# EAGLE design prize_delivery (EAGLE 9.6.2)
REV: 5
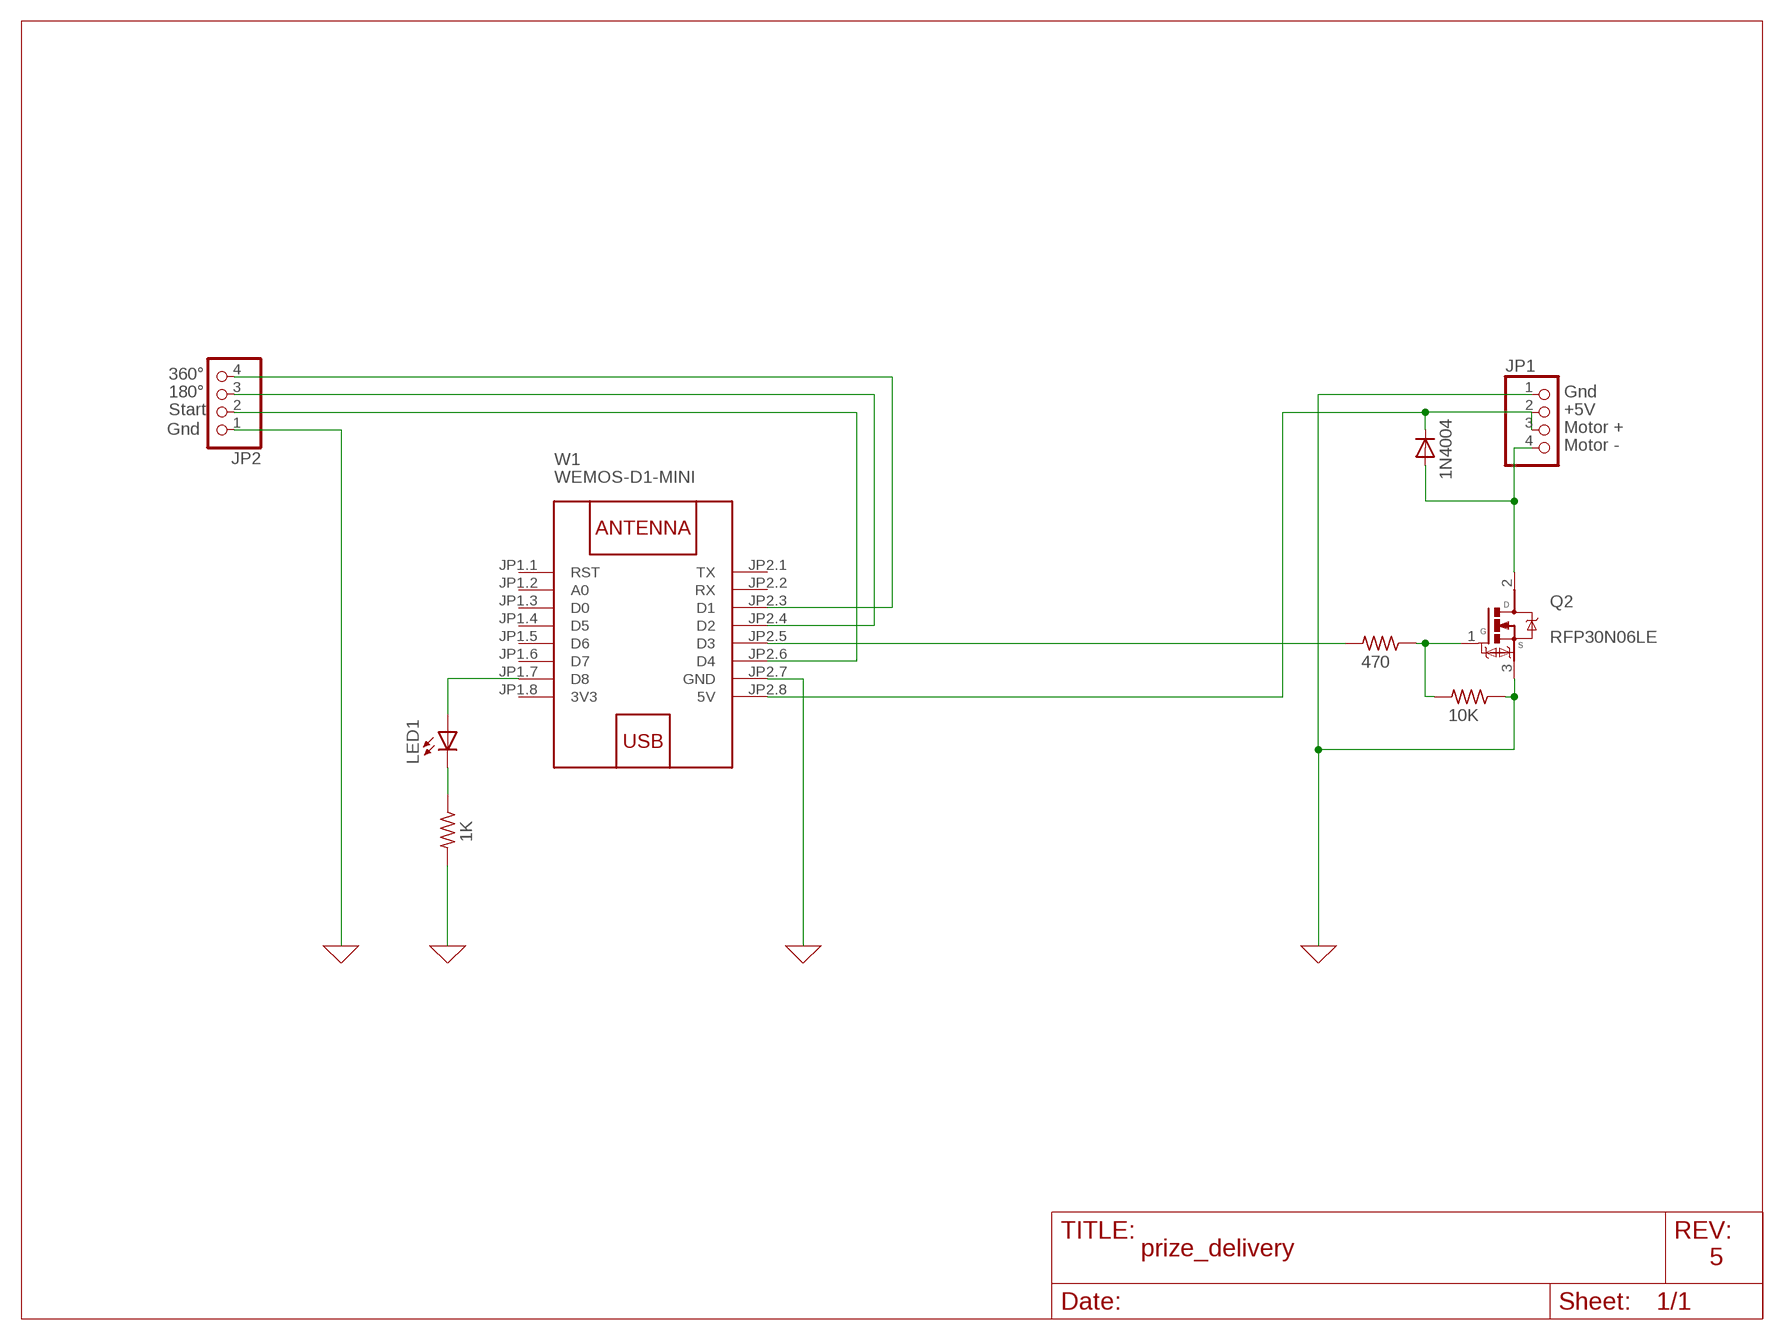
[diagram p0: schematic, sheet 1]

## Parts
D1  1N4004  [DO41-10]
JP1  PINHD-1X4  [1X04]
JP2  PINHD-1X4  [1X04]
LED1  LED5MM  [LED5MM]
Q2  RFP30N06LE  [TRANS_RFP30N06LE]
R1  1K  R-US_0207/10  [0207/10]
R2  470  R-US_0207/10  [0207/10]
R4  10K  R-US_0207/10  [0207/10]
W1  WEMOS-D1-MINI  [WEMOS-D1-MINI]

## Nets
0: JP1.1 JP2.1 Q2.3(S) R1.2 R4.1 W1.JP2.7(GND) ; supply symbol labelled GND
N$1: R2.2 W1.JP2.5(D3)
N$2: D1.A JP1.4 Q2.2(D)
N$3: D1.C JP1.2 JP1.3 W1.JP2.8(5V)
N$4: JP2.3 W1.JP2.4(D2)
N$5: JP2.4 W1.JP2.3(D1)
N$6: LED1.A W1.JP1.7(D8)
N$7: LED1.K(C) R1.1
N$8: Q2.1(G) R2.1 R4.2
N$9: JP2.2 W1.JP2.6(D4)
Unconnected: W1.JP1.1(RST) W1.JP1.2(A0) W1.JP1.3(D0) W1.JP1.4(D5) W1.JP1.5(D6) W1.JP1.6(D7) W1.JP2.1(TX) W1.JP2.2(RX)

## Notes on the sheet
- 360°
- 180° | Gnd
- Start | +5V
- Gnd | Motor +
- Motor -
- 5

## Power pins joined to a net without a drawn wire
3V3: W1.JP1.8(3V3)

## Library data of the parts
D1 = adafruit:1N4004: DIODE General purpose 1N400x type rectifier (With bigger pads) http://www.ladyada.net/library/pcb/eaglelibrary.html
JP1 JP2 = pinhead:PINHD-1X4: PIN HEADER
LED1 = adafruit:LED: LED OSRAM: - CHIPLED LG R971, LG N971, LY N971, LG Q971, LY Q971, LO R971, LY R971 LH N974, LH R974 LS Q976, LO Q976, LY Q976 LO Q996 - Hyper CHIPLED LW Q18S LB Q993, LB Q99A, LB R99A - SideLED LS A670, LO A670, LY A670, LG A670, LP A670 LB A673, LV A673, LT A673, LW A673 LH A674 LY A675 LS A676, LA A676, LO A676, LY A676, LW A676 LS A679, LY A679, LG A679 - Hyper Micro SIDELED® LS Y876, LA Y876, LO Y876, LY Y876 LT Y87S - SmartLED LW L88C, LW L88S LB L89C, LB L89S, LG L890 LS L89K, LO L89K, LY L89K LS L896, LA L896, LO L896, LY L896 - TOPLED LS T670, LO T670, LY T670, LG T670, LP T670 LSG T670, LSP T670, LSY T670, LOP T670, LYG T670 LG T671, LOG T671, LSG T671 LB T673, LV T673, LT T673, LW T673 LH T674 LS T676, LA T676, LO T676, LY T676, LB T676, LH T676, LSB T676, LW T676 LB T67C, LV T67C, LT T67C, LS T67K, LO T67K, LY T67K, LW E67C LS E67B, LA E67B, LO E67B, LY E67B, LB E67C, LV E67C, LT E67C LW T67C LS T679, LY T679, LG T679 LS T770, LO T770, LY T770, LG T770, LP T770 LB T773, LV T773, LT T773, LW T773 LH T774 LS E675, LA E675, LY E675, LS T675 LS T776, LA T776, LO T776, LY T776, LB T776 LHGB T686 LT T68C, LB T68C - Hyper Mini TOPLED® LB M676 - Mini TOPLED Santana® LG M470 LS M47K, LO M47K, LY M47K Source: http://www.osram.convergy.de/
Q2 = RFP30N06LE:RFP30N06LE: Mosfet n-Ch 60v 30a To-220ab - Rfp30n06le Check availability <https://pricing.snapeda.com/parts/RFP30N06LE/ON%20Semiconductor/view-part?ref=eda>; AVAILABILITY: In Stock; DESCRIPTION: N-Channel 60 V 30A (Ta) 96W (Tc) Through Hole TO-220-3; MF: ON Semiconductor; MP: RFP30N06LE; PACKAGE: Package; PRICE: None; PURCHASE-URL: https://pricing.snapeda.com/search?q=RFP30N06LE&ref=eda
R1 R2 R4 = adafruit:R-US_: RESISTOR, American symbol
W1 = diy-modules:WEMOS-D1-MINI: WEMOS D1 mini: Mini Wi-Fi Board based on ESP-8266 device More details can be found here: https://www.wemos.cc/product/d1-mini.html Click here to find device on ebay.com <http://www.ebay.com/sch/wemos+d1+mini+nodemcu>

## Board
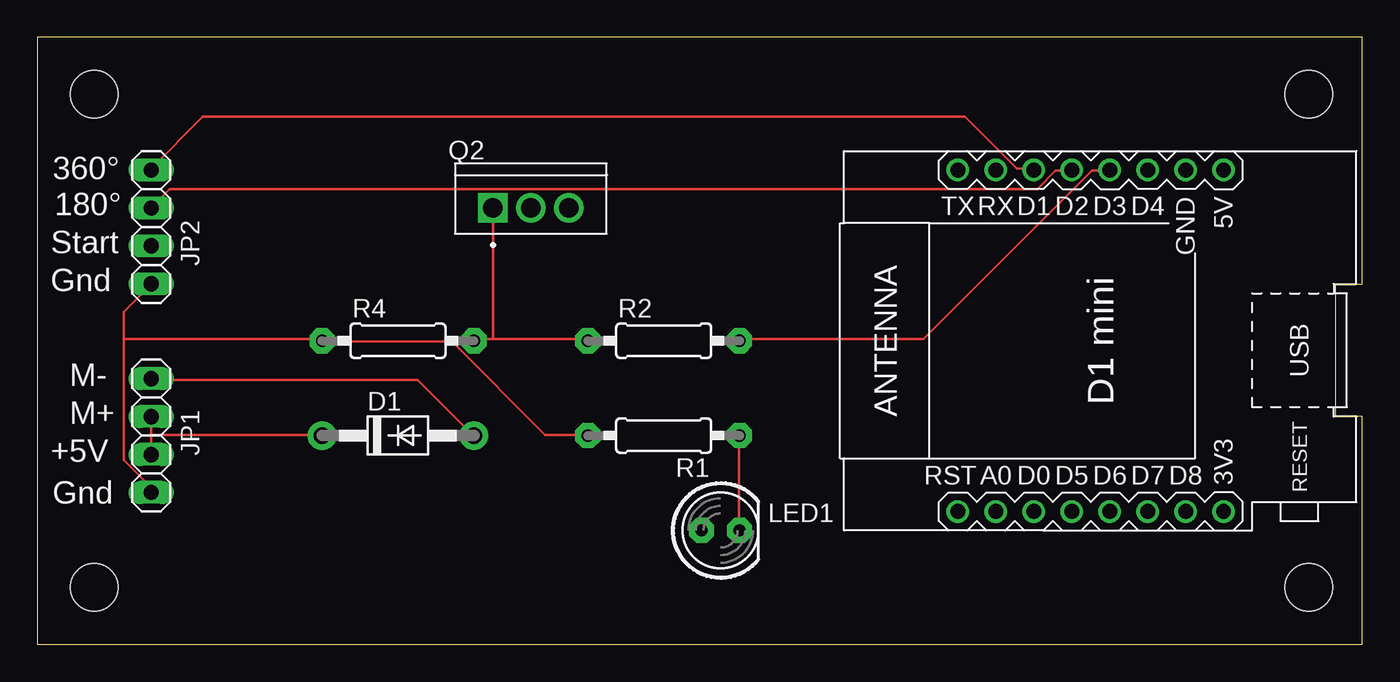
[diagram p1: board, top side]
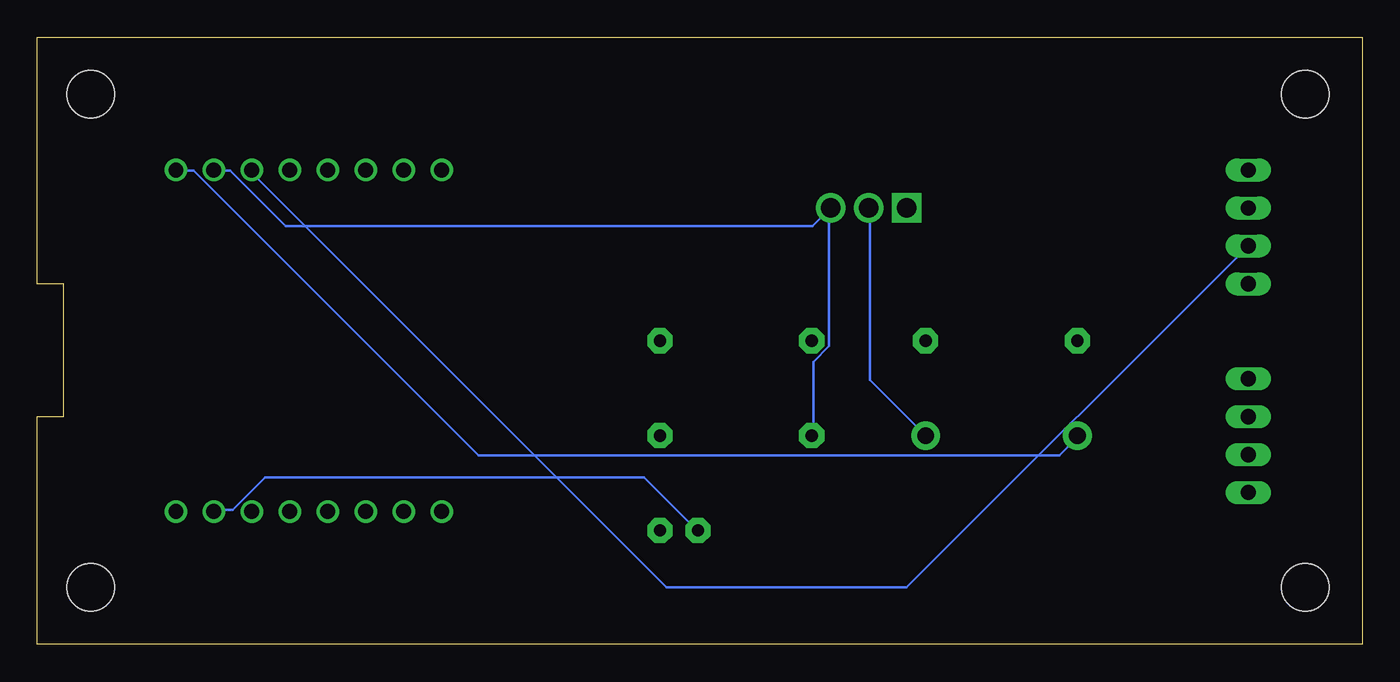
[diagram p2: board, bottom side, seen from below]

Size 88.65 x 40.63 mm. Coordinates in mm from the lower left corner, seen from the top.
Outline: 0,0 88.65,0 88.65,15.24 86.87,15.24 86.87,24.13 88.65,24.13 88.65,40.63 0,40.63 0,0
Copper layers (1*16): Top 0.035mm / dielectric 1.5mm / Bottom 0.035mm
Design rules "default": minimum track width 6mil, minimum drill 0.35mm, track to track 6mil, track to pad 6mil, pad to pad 6mil, via to via 6mil, smd to smd 6mil, copper to edge 40mil, drill to drill 6mil, minimum pad ring 10mil, minimum via ring 8mil, stop-mask expansion 4mil, vias tented up to drill 0mil, thermal gap 10mil
Holes 3.17 mm at 3.81,36.83 3.81,3.81 85.09,3.81 85.09,36.83

### Footprints (pad centres in the part's own frame; a part is rotated, then mirrored left to right if it is on the bottom)
DO41-10 = drill 1.118 pad 1.93: A 5.08,0; C -5.08,0
1X04 = drill 1.016 long: 1 -3.81,0; 2 -1.27,0; 3 1.27,0; 4 3.81,0
LED5MM = drill 0.813 pad 1.676 octagon: A -1.27,0; K 1.27,0
TRANS_RFP30N06LE = drill 1.32 square: 1 -2.54,0 | drill 1.32: 2 0,0; 3 2.54,0
0207/10 = drill 0.813 pad 1.676 octagon: 1 -5.08,0; 2 5.08,0
WEMOS-D1-MINI = drill 1: JP1.1 -11.43,9.525; JP1.2 -11.43,6.985; JP1.3 -11.43,4.445; JP1.4 -11.43,1.905; JP1.5 -11.43,-0.635; JP1.6 -11.43,-3.175; JP1.7 -11.43,-5.715; JP1.8 -11.43,-8.255; JP2.1 11.43,9.525; JP2.2 11.43,6.985; JP2.3 11.43,4.445; JP2.4 11.43,1.905; JP2.5 11.43,-0.635; JP2.6 11.43,-3.175; JP2.7 11.43,-5.715; JP2.8 11.43,-8.255

### Placement (x,y rotation side)
D1  24.13,13.97 0 top
JP1  7.62,13.97 90 top
JP2  7.62,27.94 90 top
LED1  45.72,7.62 0 top
Q2  33.02,29.21 0 top
R1  41.91,13.97 180 top
R2  41.91,20.32 0 top
R4  24.13,20.32 0 top
W1  71.12,20.32 90 top

### Tracks (layer width: path | path; a pad name or v marks a point on that pad's centre or on a via)
0
  Top 0.152: JP1.1 7.62,10.52 5.79,12.34 5.79,20.42 | 5.79,20.42 5.79,22.25 7.62,24.08 JP2.1 | 5.79,20.42 19.05,20.42 R4.1 19.05,20.27 27.74,20.27 33.98,14.02 36.73,14.02 R1.2
  Bottom 0.152: W1.JP2.7 76.81,31.7 75.74,31.7 72.03,27.99 36.78,27.99 Q2.3 35.66,29.11 35.66,19.96 36.73,18.9 36.73,14.02 R1.2
N$1
  Top 0.152: W1.JP2.5 71.63,31.7 70.56,31.7 59.28,20.42 47.09,20.42 R2.2
N$2
  Top 0.152: JP1.4 7.62,17.68 25.45,17.68 29.11,14.02 D1.A
  Bottom 0.152: D1.A 32.92,17.68 32.92,29.11 Q2.2
N$3
  Top 0.152: JP1.3 7.62,14.02 | 7.62,14.02 JP1.2 | 7.62,14.02 19.05,14.02 D1.C
  Bottom 0.152: W1.JP2.8 79.25,31.7 78.18,31.7 59.13,12.65 20.27,12.65 19.05,13.87 D1.C
N$4
  Top 0.152: W1.JP2.4 69.19,31.7 68.12,31.7 66.9,30.48 8.84,30.48 7.62,29.26 JP2.3
N$5
  Top 0.152: W1.JP2.3 66.6,31.85 65.53,31.85 62.08,35.31 11.07,35.31 7.62,31.85 JP2.4
N$6
  Bottom 0.152: W1.JP1.7 76.81,8.99 75.59,8.99 73.41,11.18 48.06,11.18 44.5,7.62 LED1.A
N$7
  Top 0.152: LED1.K 46.94,7.62 46.94,13.87 R1.1
N$8
  Top 0.152: 30.48,20.42 36.73,20.42 R2.1 | 30.48,20.42 29.26,20.42 R4.2 | 30.48,20.42 Q2.1
N$9
  Bottom 0.152: W1.JP2.6 74.29,31.57 46.53,3.81 30.48,3.81 JP2.2

### Text on the board
tNames: 360° | 180° | Start | Gnd | M- | M+ | +5V | Gnd